# EAGLE design Superprobe.v1a (EAGLE 5.10)
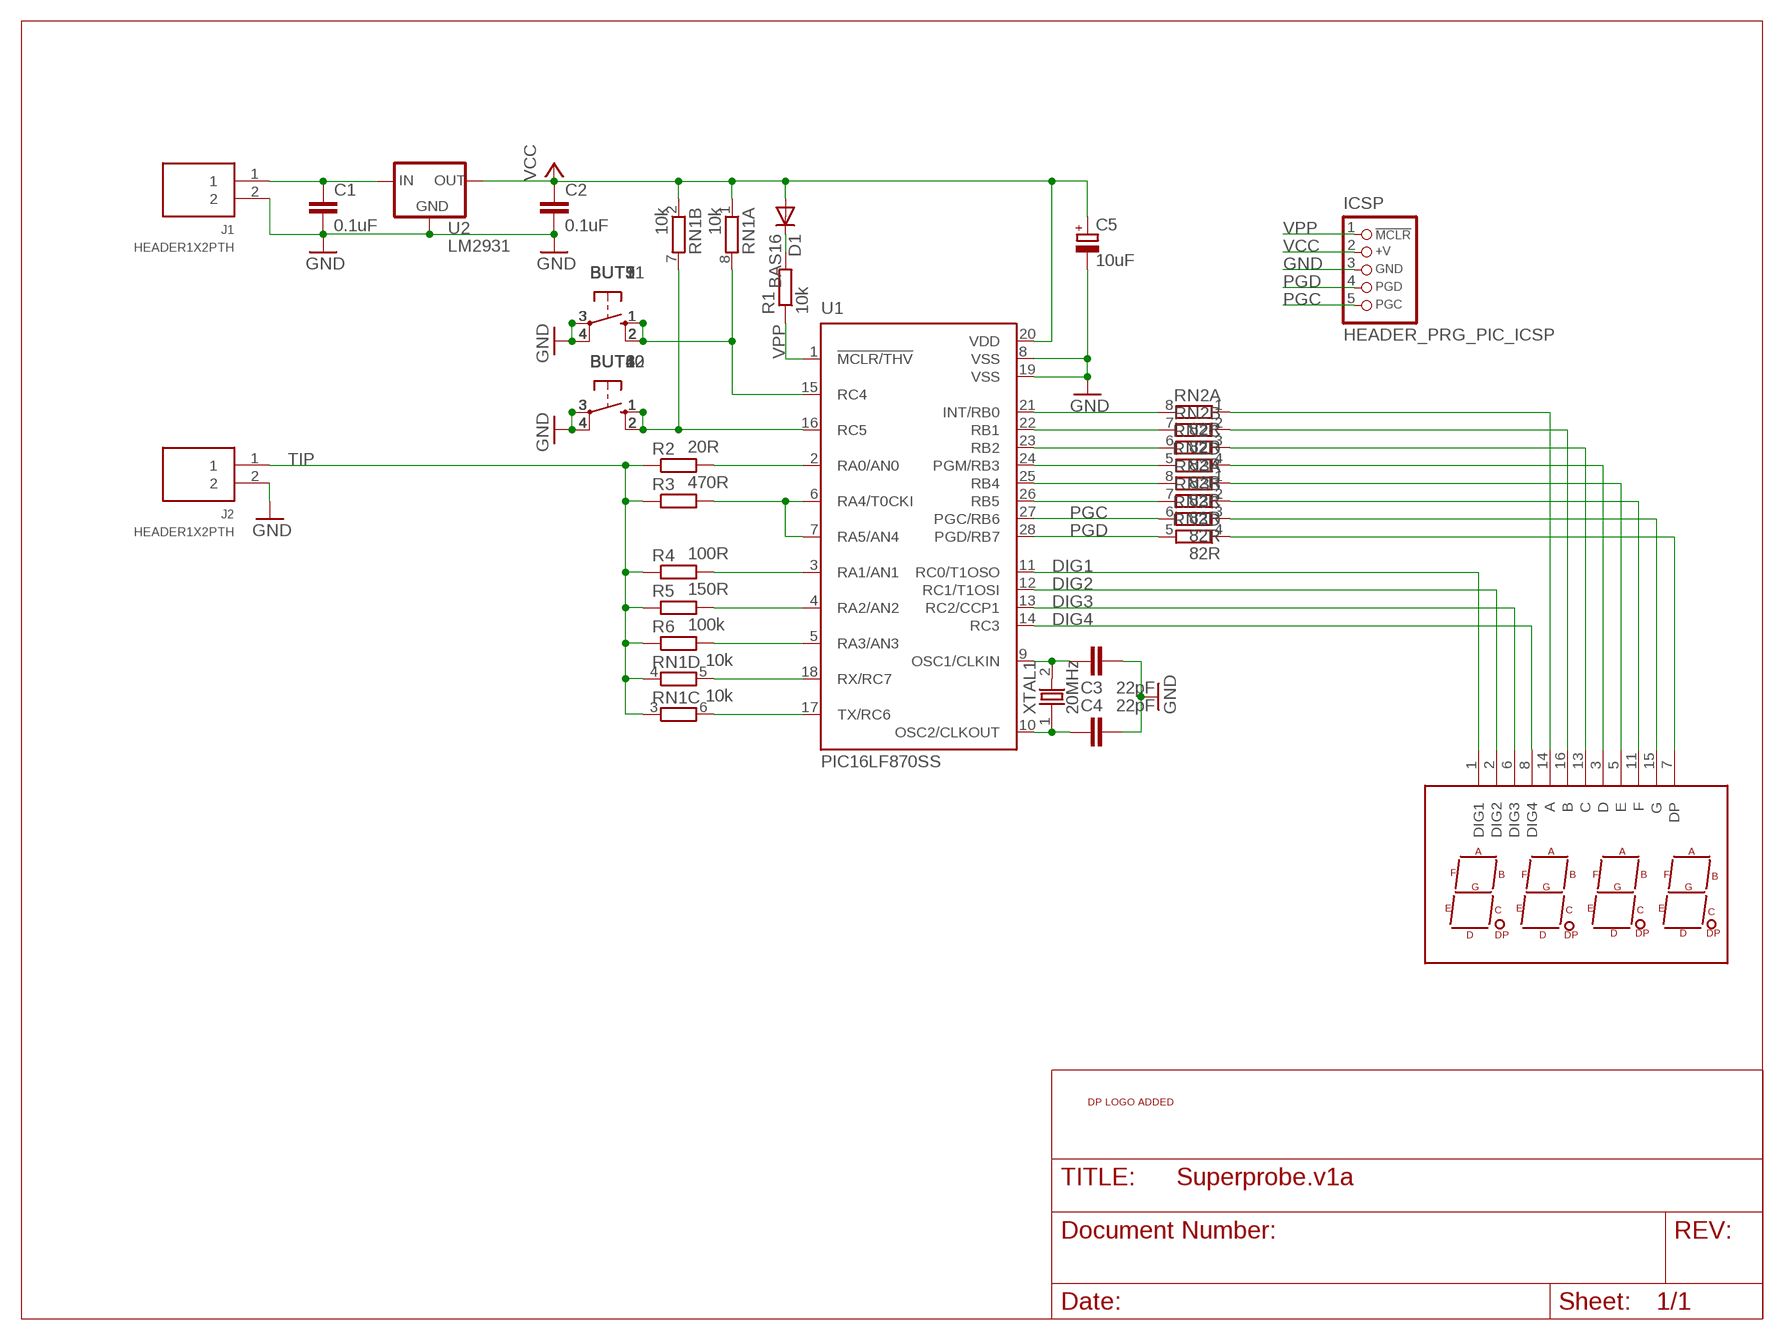
[diagram p0: schematic, sheet 1]

## Parts
BUT1  KMS231GPLFS  [KMS231GPLFS]
BUT2  KMS231GPLFS  [KMS231GPLFS]
BUT3  KMS231GPLFS  [KMS231GPLFS]
BUT4  KMS231GPLFS  [KMS231GPLFS]
BUT5  KMS231GPLFS  [KMS231GPLFS]
BUT6  KMS231GPLFS  [KMS231GPLFS]
BUT7  KMS231GPLFS  [KMS231GPLFS]
BUT8  KMS231GPLFS  [KMS231GPLFS]
BUT9  KMS231GPLFS  [KMS231GPLFS]
BUT10  KMS231GPLFS  [KMS231GPLFS]
BUT11  KMS231GPLFS  [KMS231GPLFS]
BUT12  KMS231GPLFS  [KMS231GPLFS]
C1  0.1uF  CAPC603  [C603]
C2  0.1uF  CAPC603  [C603]
C3  22pF  CAPC603  [C603]
C4  22pF  CAPC603  [C603]
C5  10uF  CAP_POLSMC_A  [SMC_A]
D1  BAS16  DIODEDO323  [DO323]
ICSP  HEADER_PRG_PIC_ICSP  [HEADER_PRG_1X05]
J1  HEADER1X2PTH  [M1X2]
J2  HEADER1X2PTH  [M1X2]
R1  10k  RESISTORR603  [R603]
R2  20R  RESISTORR603  [R603]
R3  470R  RESISTORR603  [R603]
R4  100R  RESISTORR603  [R603]
R5  150R  RESISTORR603  [R603]
R6  100k  RESISTORR603  [R603]
RN1  10k  RNETWORK  [RN8P-4R-CRA06S]
RN2  82R  RNETWORK  [RN8P-4R-CRA06S]
RN3  82R  RNETWORK  [RN8P-4R-CRA06S]
U1  PIC16LF870SS  [SSOP28]
U2  LM2931  LM2931ADT-5.0G  [DPACK]
U3  LTC-4627  [LTC-4627]
U$1  DP_LOGO  [DP_LOGO]
XTAL1  20MHz  CRYSTAL  [HC-49U]

## Nets
DIG1: U1.11(RC0/T1OSO) U3.1(DIG1)
DIG2: U1.12(RC1/T1OSI) U3.2(DIG2)
DIG3: U1.13(RC2/CCP1) U3.6(DIG3)
DIG4: U1.14(RC3) U3.8(DIG4)
GND: BUT1.3 BUT1.4 BUT2.3 BUT2.4 BUT3.3 BUT3.4 BUT4.3 BUT4.4 BUT5.3 BUT5.4 BUT6.3 BUT6.4 BUT7.3 BUT7.4 BUT8.3 BUT8.4 BUT9.3 BUT9.4 BUT10.3 BUT10.4 BUT11.3 BUT11.4 BUT12.3 BUT12.4 C1.2 C2.2 C3.2 C4.2 C5.- ICSP.3(GND) J1.2 J2.2 U1.8(VSS) U1.19(VSS) U2.4(GND)
N$1: C1.1 J1.1 U2.1(IN)
N$2: RN2.8 U1.21(INT/RB0)
N$3: R2.2 U1.2(RA0/AN0)
N$4: R3.2 U1.6(RA4/T0CKI) U1.7(RA5/AN4)
N$7: R4.2 U1.3(RA1/AN1)
N$8: R5.2 U1.4(RA2/AN2)
N$9: R6.2 U1.5(RA3/AN3)
N$10: RN1.5 U1.18(RX/RC7)
N$11: RN1.6 U1.17(TX/RC6)
N$12: C3.1 U1.9(OSC1/CLKIN) XTAL1.2
N$13: C4.1 U1.10(OSC2/CLKOUT) XTAL1.1
N$14: RN2.1 U3.14(A)
N$15: RN2.2 U3.16(B)
N$16: RN2.3 U3.13(C)
N$17: RN2.4 U3.3(D)
N$18: RN3.1 U3.5(E)
N$19: RN3.2 U3.11(F)
N$20: RN2.7 U1.22(RB1)
N$21: RN2.6 U1.23(RB2)
N$24: BUT1.1 BUT1.2 BUT3.1 BUT3.2 BUT5.1 BUT5.2 BUT7.1 BUT7.2 BUT9.1 BUT9.2 BUT11.1 BUT11.2 RN1.8 U1.15(RC4)
N$26: RN2.5 U1.24(PGM/RB3)
N$27: RN3.3 U3.15(G)
N$28: RN3.4 U3.7(DP)
N$29: D1.C R1.2
N$31: RN3.7 U1.26(RB5)
N$32: RN3.8 U1.25(RB4)
N$33: BUT2.1 BUT2.2 BUT4.1 BUT4.2 BUT6.1 BUT6.2 BUT8.1 BUT8.2 BUT10.1 BUT10.2 BUT12.1 BUT12.2 RN1.7 U1.16(RC5)
PGC: ICSP.5(PGC) RN3.6 U1.27(PGC/RB6)
PGD: ICSP.4(PGD) RN3.5 U1.28(PGD/RB7)
TIP: J2.1 R2.1 R3.1 R4.1 R5.1 R6.1 RN1.3 RN1.4
VCC: C2.1 C5.+ D1.A ICSP.2(+V) RN1.1 RN1.2 U1.20(VDD) U2.3(OUT)
VPP: ICSP.1(/MCLR) R1.1 U1.1(!MCLR/THV)

## Library data of the parts
BUT1-BUT12 = sw-2:KMS231G
C1-C4 = dp_devices:CAP
C5 = dp_devices:CAP_POL
D1 = dp_devices:DIODE
ICSP = dp_devices:HEADER_PRG_PIC_ICSP: 5-pin PIC In Circuit Serial Programming header
J1 J2 = dp_devices:HEADER1X2
R1-R6 = dp_devices:RESISTOR
RN1-RN3 = dp_devices:RNETWORK: 4 Resistor Array 0603
U1 = microchip2:PIC16*870: MICROCONTROLLER flash type; MF: MICROCHIP; MPN: PIC16LF870-I/SS; OC_FARNELL: 1818506; OC_NEWARK: 23C5704
U2 = j:LM2931: VOLTAGE REGULATOR
U3 = j:LTC-4627: This is a part for the 4-Digit 7-segment LEDs from Young Sun. Different from the Digikey LEDs, all 16 pins are used. The LONGPADS Variant is used for a test jig, but you may like it because there is more pad to solder to. If you are concerned about routing space, the standard works just fine though.
U$1 = dp_devices:DP_LOGO; LICENSE: CC-BY-SA; PROJECT: project
XTAL1 = dp_devices:CRYSTAL

## Board
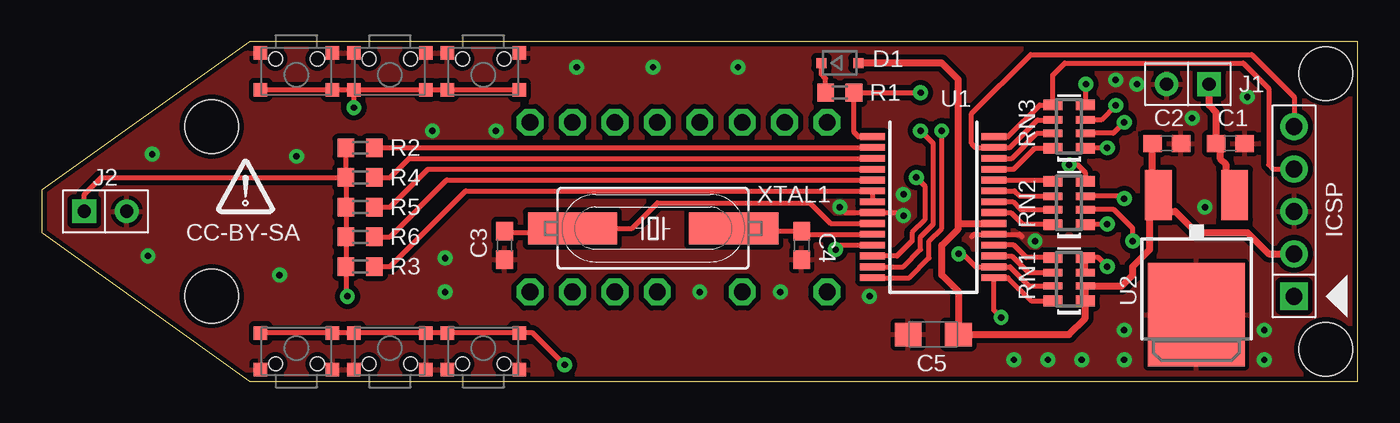
[diagram p1: board, top side]
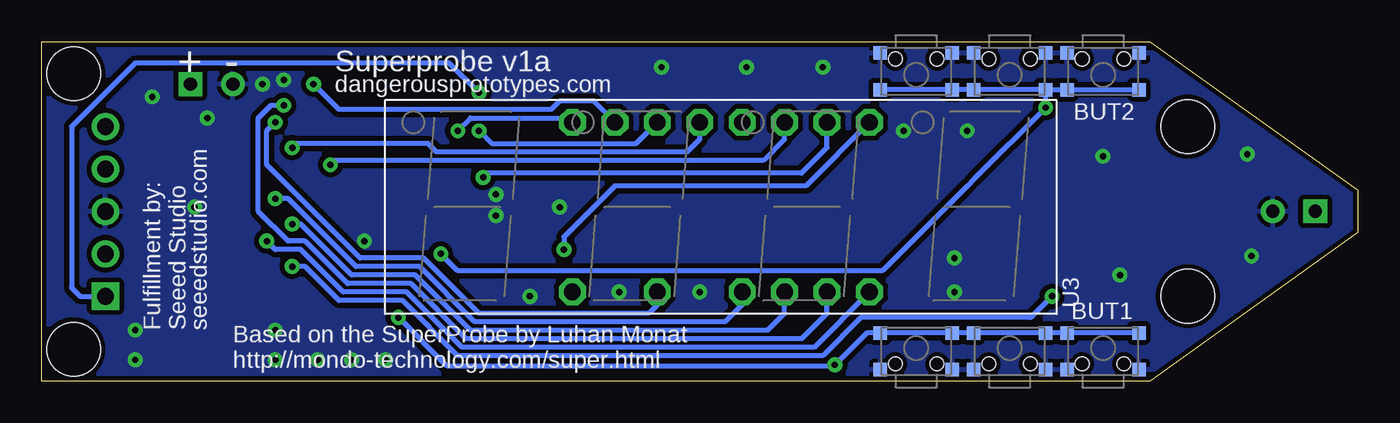
[diagram p2: board, bottom side, seen from below]

Size 78.74 x 20.32 mm. Coordinates in mm from the lower left corner, seen from the top.
Outline: 0,8.89 12.45,0 78.74,0 78.74,20.32 12.45,20.32 0,11.43 0,8.89
Copper layers (1*16): Top 0.035mm / dielectric 1.5mm / Bottom 0.035mm
Design rules "SparkFun *": minimum track width 8mil, minimum drill 13mil, track to track 8mil, track to pad 8mil, pad to pad 8mil, via to via 8mil, smd to smd 8mil, copper to edge 10mil, drill to drill 8mil, minimum pad ring 12mil, minimum via ring 10mil, stop-mask expansion 4mil, vias tented up to drill 25mil, thermal gap 10mil
Holes 3.2 mm at 10.16,5.08 10.16,15.24 76.83,18.41 76.83,1.91

### Footprints (pad centres in the part's own frame; a part is rotated, then mirrored left to right if it is on the bottom)
KMS231GPLFS = smd 0.8 x 0.8: 1 -2.154,1.1; 2 2.154,1.1; 3 -2.154,-1.1; 4 2.154,-1.1 | hole 0.8: -1.25,-0.75; 1.25,-0.75
C603 = smd 1.1 x 1: 1 -0.85,0; 2 0.85,0
SMC_A = smd 1.6 x 1.4: + -1.5,0; - 1.5,0
DO323 = smd 0.6 x 0.6: A 1.1,0; C -1.1,0
HEADER_PRG_1X05 = drill 1.016 square: 1 -5.08,0 | drill 1.016 round: 2 -2.54,0; 3 0,0; 4 2.54,0; 5 5.08,0
M1X2 = drill 0.8 square: 1 -1.27,0 | drill 0.8 round: 2 1.27,0
R603 = smd 1 x 1.1: 1 -0.85,0; 2 0.85,0
RN8P-4R-CRA06S = smd 0.63 x 1.15: 1 -1.295,-0.975; 4 1.295,-0.975; 5 1.295,0.975; 8 -1.295,0.975 | smd 0.44 x 1.15: 2 -0.4,-0.975; 3 0.4,-0.975; 6 0.4,0.975; 7 -0.4,0.975
SSOP28 = smd 0.4 x 1.5: 1 -4.225,-3.625; 2 -3.575,-3.625; 3 -2.925,-3.625; 4 -2.275,-3.625; 5 -1.625,-3.625; 6 -0.975,-3.625; 7 -0.325,-3.625; 8 0.325,-3.625; 9 0.975,-3.625; 10 1.625,-3.625; 11 2.275,-3.625; 12 2.925,-3.625; 13 3.575,-3.625; 14 4.225,-3.625; 15 4.225,3.625; 16 3.575,3.625; 17 2.925,3.625; 18 2.275,3.625; 19 1.625,3.625; 20 0.975,3.625; 21 0.325,3.625; 22 -0.325,3.625; 23 -0.975,3.625; 24 -1.625,3.625; 25 -2.275,3.625; 26 -2.925,3.625; 27 -3.575,3.625; 28 -4.225,3.625
DPACK = smd 1.6 x 3: 1 -2.28,-4.8; 3 2.28,-4.8 | smd 5.8 x 6.2: 4 0,2.38
LTC-4627 = drill 1 octagon: 1 -8.89,-5.08; 2 -6.35,-5.08; 3 -3.81,-5.08; 4 -1.27,-5.08; 5 1.27,-5.08; 6 3.81,-5.08; 7 6.35,-5.08; 8 8.89,-5.08; 9 8.89,5.08; 11 3.81,5.08; 13 -1.27,5.08; 14 -3.81,5.08; 15 -6.35,5.08; 16 -8.89,5.08
HC-49U = smd 5.334 x 1.93: 1 -4.826,0; 2 4.826,0

### Placement (x,y rotation side)
BUT1  15.24,1.78 0 bottom
BUT2  15.24,18.54 180 bottom
BUT3  20.83,1.78 0 bottom
BUT4  20.83,18.54 180 bottom
BUT5  26.42,1.78 0 bottom
BUT6  26.42,18.54 180 bottom
BUT7  20.83,1.78 0 top
BUT8  20.83,18.54 180 top
BUT9  15.24,1.78 0 top
BUT10  15.24,18.54 180 top
BUT11  26.42,1.78 0 top
BUT12  26.42,18.54 180 top
C1  0.1u  [C603]  71.12,14.22 0 top
C2  0.1u  [C603]  67.31,14.22 0 top
C3  27.69,8.13 270 top
C4  45.47,8.13 270 top
C5  53.34,2.79 180 top
D1  [DO323]  47.75,19.05 0 top
ICSP  74.93,10.16 90 top
J1  68.58,17.78 180 top
J2  3.81,10.16 0 top
R1  47.75,17.27 180 top
R2  20  [R603]  19.05,13.97 0 top
R3  470  [R603]  19.05,6.86 0 top
R4  100  [R603]  19.05,12.19 0 top
R5  150  [R603]  19.05,10.41 0 top
R6  19.05,8.64 0 top
RN1  61.47,6.1 90 top
RN2  330  [RN8P-4R-CRA06S]  61.47,10.67 90 top
RN3  330  [RN8P-4R-CRA06S]  61.47,15.24 90 top
U1  53.34,10.41 270 top
U2  [DPACK]  69.09,6.35 180 top
U3  38.1,10.41 180 bottom
U$1  12.19,10.67 0 top
XTAL1  36.58,9.14 180 top

### Tracks (layer width: path | path; a pad name or v marks a point on that pad's centre or on a via)
DIG1  (via drill 0.38)
  Top 0.305: U1.11 47.76,8.14 v47.5,7.87
  Bottom 0.305: v47.5,7.87 47.5,8.64 44.45,11.68 33.02,11.68 U3.1
DIG2  (via drill 0.38)
  Top 0.305: U1.12 51.18,7.49 52.07,8.38 52.07,8.89 52.83,9.65 52.83,11.68 v52.32,12.19
  Bottom 0.305: v52.32,12.19 52.07,12.45 33.27,12.45 31.75,13.97 U3.2
DIG3  (via drill 0.38)
  Top 0.305: U1.13 51.54,6.84 52.58,7.87 52.58,8.64 53.34,9.4 53.34,14.22 v52.58,14.99
  Bottom 0.305: v52.58,14.99 51.82,14.22 43.18,14.22 U3.6
DIG4  (via drill 0.38)
  Top 0.305: U1.14 51.91,6.19 53.09,7.37 53.09,8.38 53.85,9.14 v53.85,14.99
  Bottom 0.305: U3.8 47.24,15.75 53.09,15.75 v53.85,14.99
GND  (via drill 0.38)
  Top 0.305: 55.63,8.64 55.78,8.79 U1.19 58.52,8.79 58.67,8.64 | 51.31,9.91 51.12,10.09 U1.8 48.08,10.09 v47.75,10.41
  other vias: 44.2,5.33 59.44,8.38 72.14,17.02 65.53,17.78 68.83,15.75 69.6,10.41 64.77,3.05 64.77,1.27 73.15,1.27 73.15,3.05 62.23,1.27 60.2,1.27 58.17,1.27 14.22,6.35 15.24,13.46 27.18,14.99 32,18.8 23.37,14.99 6.6,13.59 39.37,5.33 49.53,5.08 51.56,11.18 51.56,9.91 36.58,18.8 41.66,18.8 64.26,18.03 24.13,7.37 24.13,5.33 6.35,7.49
  pour Top (isolate 0.305): 0,0 78.74,0 78.74,20.32 0,20.32
  pour Bottom (isolate 0.305): 0,0 78.74,0 78.74,20.32 0,20.32
N$1
  Top 0.406: U2.1 70.87,11.65 70.87,12.95 70.52,13.3 70.52,13.72 C1.1 70.27,16.09 69.85,16.51 J1.1
N$2
  Top 0.305: U1.21 57.98,10.09 58.67,9.4 60.45,9.4 60.48,9.37 RN2.8
N$3
  Top 0.305: R2.2 49.7,13.97 U1.2
N$4
  Top 0.305: U1.7 U1.6 25.36,11.39 20.83,6.86 R3.2
N$7
  Top 0.305: U1.3 21.98,13.34 20.83,12.19 R4.2
N$8
  Top 0.305: U1.4 23.1,12.69 20.83,10.41 R5.2
N$9
  Top 0.305: U1.5 24.23,12.04 20.83,8.64 R6.2
N$10
  Top 0.305: U1.18 58.16,8.14 58.9,7.39 RN1.5
N$11
  Top 0.305: U1.17 58.04,7.49 59.04,6.5 RN1.6
N$12
  Top 0.305: U1.9 47.2,9.44 45.97,10.67 36.83,10.67 35.31,9.14 XTAL1.2 29.72,8.64 29.72,8.89 28.03,8.89 C3.1
N$13
  Top 0.305: U1.10 45.57,8.79 45.47,8.89 45.3,8.89 C4.1 42,8.98 XTAL1.1
N$14  (via drill 0.38)
  Top 0.305: RN2.1 63.73,9.37 v63.75,9.4
  Bottom 0.305: v63.75,9.4 63.25,9.4 60.2,6.35 56.39,6.35 53.09,3.05 35.31,3.05 34.29,4.06 U3.14
N$15  (via drill 0.38)
  Top 0.305: RN2.2 64.15,10.27 65.28,9.14 v65.28,8.38
  Bottom 0.305: U3.16 32.51,2.03 53.59,2.03 56.9,5.33 60.71,5.33 63.25,7.87 64.77,7.87 v65.28,8.38
N$16  (via drill 0.38)
  Top 0.305: RN2.3 64.66,11.07 v64.77,10.92
  Bottom 0.305: v64.77,10.92 64.01,10.92 59.94,6.86 56.13,6.86 52.83,3.56 37.85,3.56 36.83,4.57 U3.13
N$17  (via drill 0.38)
  Top 0.305: RN2.4 62.44,12.49 61.98,12.95 v61.47,12.95
  Bottom 0.305: v61.47,12.95 61.21,13.21 35.56,13.21 34.29,14.48 U3.3
N$18  (via drill 0.38)
  Top 0.305: RN3.1 63.73,13.95 v63.75,13.97
  Bottom 0.305: U3.5 39.37,14.48 40.13,13.72 55.12,13.72 55.63,14.22 63.5,14.22 v63.75,13.97
N$19  (via drill 0.38)
  Top 0.305: RN3.2 64.12,14.84 v64.77,15.49
  Bottom 0.305: U3.11 41.91,4.57 42.42,4.06 52.58,4.06 55.88,7.37 59.69,7.37 65.28,12.95 65.28,14.99 v64.77,15.49
N$20
  Top 0.305: U1.22 58.09,10.74 58.57,10.27 RN2.7
N$21
  Top 0.305: U1.23 58.21,11.39 58.53,11.07 RN2.6
N$24  (via drill 0.38)
  Top 0.305: RN1.8 59.21,4.8 57.82,6.19 U1.15 56.97,4.25 v57.4,3.81 | BUT1.2 BUT1.1 BUT7.1 BUT3.1 BUT11.1 BUT5.1 29.38,2.88 v31.29,0.97
  Bottom 0.305: v57.4,3.81 54.48,0.89 31.37,0.89 v31.29,0.97 29.38,2.88 BUT5.1 BUT11.1 BUT3.1 BUT7.1 BUT1.1 BUT1.2
N$26
  Top 0.305: U1.24 60.42,12.04 RN2.5
N$27  (via drill 0.38)
  Top 0.305: RN3.3 63.39,15.64 v64.26,16.51
  Bottom 0.305: v64.26,16.51 65.02,16.51 65.79,15.75 65.79,10.16 64.01,8.38 62.99,8.38 60.45,5.84 56.64,5.84 53.34,2.54 33.27,2.54 31.75,4.06 U3.15
N$28  (via drill 0.38)
  Top 0.305: RN3.4 62.44,17.74 v62.48,17.78
  Bottom 0.305: U3.7 45.72,16.76 47.75,16.76 48.26,16.26 60.96,16.26 v62.48,17.78
N$29
  Top 0.305: R1.2 46.9,18.12 46.65,18.37 D1.C
N$31
  Top 0.305: U1.26 58.04,13.34 59.54,14.84 RN3.7
N$32
  Top 0.305: U1.25 58.16,12.69 59.41,13.95 RN3.8
N$33  (via drill 0.38)
  Top 0.305: RN1.7 59.07,5.7 57.93,6.84 U1.16 55.9,6.84 55.12,7.62 v54.86,7.62 | BUT10.2 BUT2.2 BUT8.2 | BUT8.2 BUT4.2 BUT12.2 BUT6.2 | BUT8.2 v18.67,16.38
  Bottom 0.305: BUT10.2 BUT2.2 BUT8.2 | BUT8.2 BUT4.2 BUT12.2 BUT6.2 | BUT8.2 v18.67,16.38 22.99,12.06 23.37,11.68 28.45,6.6 53.85,6.6 v54.86,7.62
PGC
  Top 0.305: RN3.6 59.58,15.64 57.93,13.99 U1.27 55.86,13.99 55.63,14.22 55.63,16 59.18,19.56 72.39,19.56 74.93,17.02 ICSP.5
PGD
  Top 0.305: U1.28 57.82,14.64 59.72,16.54 RN3.5 60.49,18.33 61.21,19.05 71.88,19.05 73.41,17.53 73.41,12.95 73.66,12.7 ICSP.4
TIP  (via drill 0.38)
  Top 0.305: RN1.3 RN1.4 63.22,7.39 v63.75,6.86 | R4.1 R2.1 | R4.1 R5.1 R6.1 R3.1 18.2,5.17 v18.29,5.08 | J2.1 2.54,11.18 3.56,12.19 R4.1
  Bottom 0.305: v63.75,6.86 62.99,6.86 60.96,4.83 57.15,4.83 53.85,1.52 32,1.52 29.72,3.81 19.56,3.81 v18.29,5.08
VCC
  Top 0.305: U2.3 66.3,10.41 66.55,10.16
  Top 0.406: C2.1 66.46,11.5 U2.3 | 66.3,10.41 66.3,7.88 65.28,6.86 65.28,6.35 64.62,5.7 RN1.2 RN1.1 62.44,3.77 61.47,2.79 C5.+ 54.86,3.07 54.86,5.33 53.85,6.35 53.85,8.13 54.84,9.12 54.84,9.4 | ICSP.2 73.41,7.62 72.14,8.89 69.09,8.89 67.82,10.16 66.55,10.16 | 54.84,9.4 54.84,18.06 53.85,19.05 D1.A | U1.20 54.88,9.44 54.84,9.4
VPP  (via drill 0.38)
  Top 0.305: U1.1 48.86,14.64 48.6,14.9 R1.1 v52.58,17.27
  Bottom 0.305: ICSP.1 76.45,5.08 76.96,5.59 76.96,15.24 73.15,19.05 54.36,19.05 v52.58,17.27

### Text on the board
tPlace: CC-BY-SA
bPlace: - | + | dangerousprototypes.com | seeedstudio.com | Seeed Studio | Fulfillment by: | Based on the SuperProbe by Luhan Monat | http://mondo-technology.com/super.html
bNames: Superprobe v1a